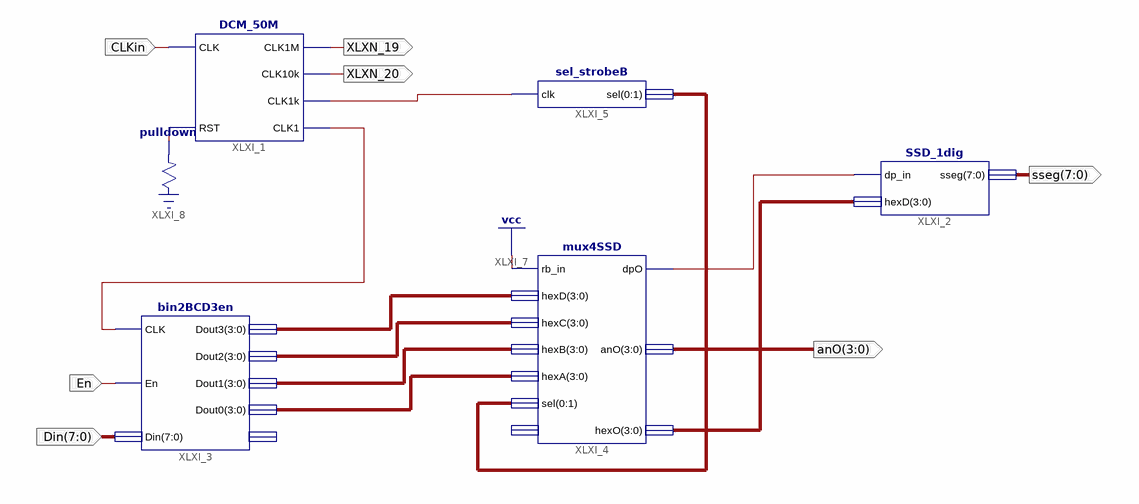
[diagram p0: schematic sheet 1]
// Xilinx ISE schematic experiment3.sch (spartan3e) as structural Verilog: 6 symbols, 7 ports
module experiment3 (
  input  En,
  input  [7:0] Din,
  input  CLKin,
  output [7:0] sseg,
  output [3:0] anO,
  output XLXN_19,
  output XLXN_20
);

  wire CLK1, XLXN_2, XLXN_5, XLXN_9;
  wire [1:0] XLXN_3;
  wire [3:0] XLXN_4, XLXN_11, XLXN_12, XLXN_13, XLXN_14;

  DCM_50M XLXI_1 (.CLK(CLKin), .RST(XLXN_2), .CLK1M(XLXN_19), .CLK10k(XLXN_20), .CLK1k(XLXN_9), .CLK1(CLK1));
  SSD_1dig XLXI_2 (.dp_in(XLXN_5), .hexD(XLXN_4), .sseg(sseg));
  bin2BCD3en XLXI_3 (
    .CLK(CLK1), .En(En), .Din(Din), .Dout3(XLXN_11), .Dout2(XLXN_12), .Dout1(XLXN_13), .Dout0(XLXN_14));  // open: RBout
  mux4SSD XLXI_4 (
    .rb_in(1'b1), .hexD(XLXN_11), .hexC(XLXN_12), .hexB(XLXN_13), .hexA(XLXN_14),
    .sel({XLXN_3[0], XLXN_3[1]}), .dpO(XLXN_5), .anO(anO), .hexO(XLXN_4));  // open: dp_in
  sel_strobeB XLXI_5 (.clk(XLXN_9), .sel({XLXN_3[0], XLXN_3[1]}));
  \pulldown  XLXI_8 (.O(XLXN_2));
endmodule
